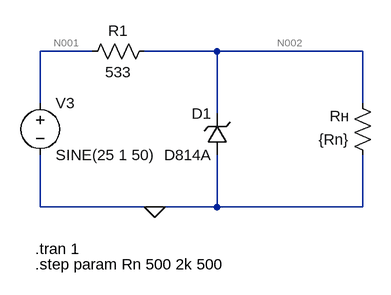
[diagram p0: schematic стабилизатор1.asc]
стабилизатор1.asc, the LTspice schematic file:
Version 4
SHEET 1 1044 680
WIRE 128 32 48 32
WIRE 320 32 208 32
WIRE 544 32 320 32
WIRE 48 112 48 32
WIRE 544 112 544 32
WIRE 320 128 320 32
WIRE 48 272 48 192
WIRE 224 272 48 272
WIRE 320 272 320 192
WIRE 320 272 224 272
WIRE 544 272 544 192
WIRE 544 272 320 272
FLAG 224 272 0
SYMBOL res 224 16 R90
WINDOW 0 0 56 VBottom 2
WINDOW 3 32 56 VTop 2
SYMATTR InstName R1
SYMATTR Value 533
SYMBOL res 560 208 R180
WINDOW 0 36 76 Left 2
WINDOW 3 36 40 Left 2
SYMATTR InstName Rн
SYMATTR Value {Rn}
SYMBOL zener 336 192 R180
WINDOW 0 24 64 Left 2
WINDOW 3 24 0 Left 2
SYMATTR InstName D1
SYMATTR Value D814A
SYMATTR Description Diode
SYMATTR Type diode
SYMBOL voltage 48 96 R0
WINDOW 123 0 0 Left 0
WINDOW 39 0 0 Left 0
SYMATTR InstName V3
SYMATTR Value SINE(25 1 50)
TEXT 40 336 Left 2 !.tran 1
TEXT 40 360 Left 2 !.step param Rn 500 2k 500

The netlist it stands for:
* стабилизатор1.asc
R1 N002 N001 533
Rн 0 N002 {Rn}
D1 0 N002 D814A
V3 N001 0 SINE(25 1 50)
.model D D
.lib standard.dio
.tran 1
.step param Rn 500 2k 500
.backanno
.end

* Results of the author's LTspice run, read from the files saved beside the schematic
* Operating Point (first step), zero values left out:
*   rn = 500 
*   V(n002) = 8.285 V
*   V(n001) = 25 V
*   I(D1) = -14.79 mA
*   I(Rн) = -16.57 mA
*   I(R1) = -31.36 mA
*   I(V3) = -31.36 mA
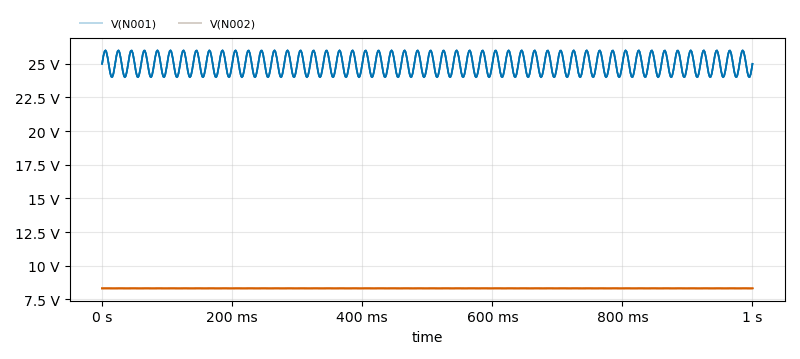
[diagram p1: Transient Analysis of стабилизатор1.asc, plotted from the saved traces]
* Transient Analysis, 4 runs:
*   V(N001) [rn=500]: min 24 V, max 26 V, average 25 V, rms 25.01 V, last 25 V
*   V(N001) [rn=1000]: min 24 V, max 26 V, average 25 V, rms 25.01 V, last 25 V
*   V(N001) [rn=1500]: min 24 V, max 26 V, average 25 V, rms 25.01 V, last 25 V
*   V(N001) [rn=2000]: min 24 V, max 26 V, average 25 V, rms 25.01 V, last 25 V
*   V(N002) [rn=500]: min 8.279 V, max 8.29 V, average 8.285 V, rms 8.285 V, last 8.285 V
*   V(N002) [rn=1000]: min 8.302 V, max 8.311 V, average 8.306 V, rms 8.306 V, last 8.306 V
*   V(N002) [rn=1500]: min 8.309 V, max 8.317 V, average 8.313 V, rms 8.313 V, last 8.313 V
*   V(N002) [rn=2000]: min 8.312 V, max 8.32 V, average 8.316 V, rms 8.316 V, last 8.316 V